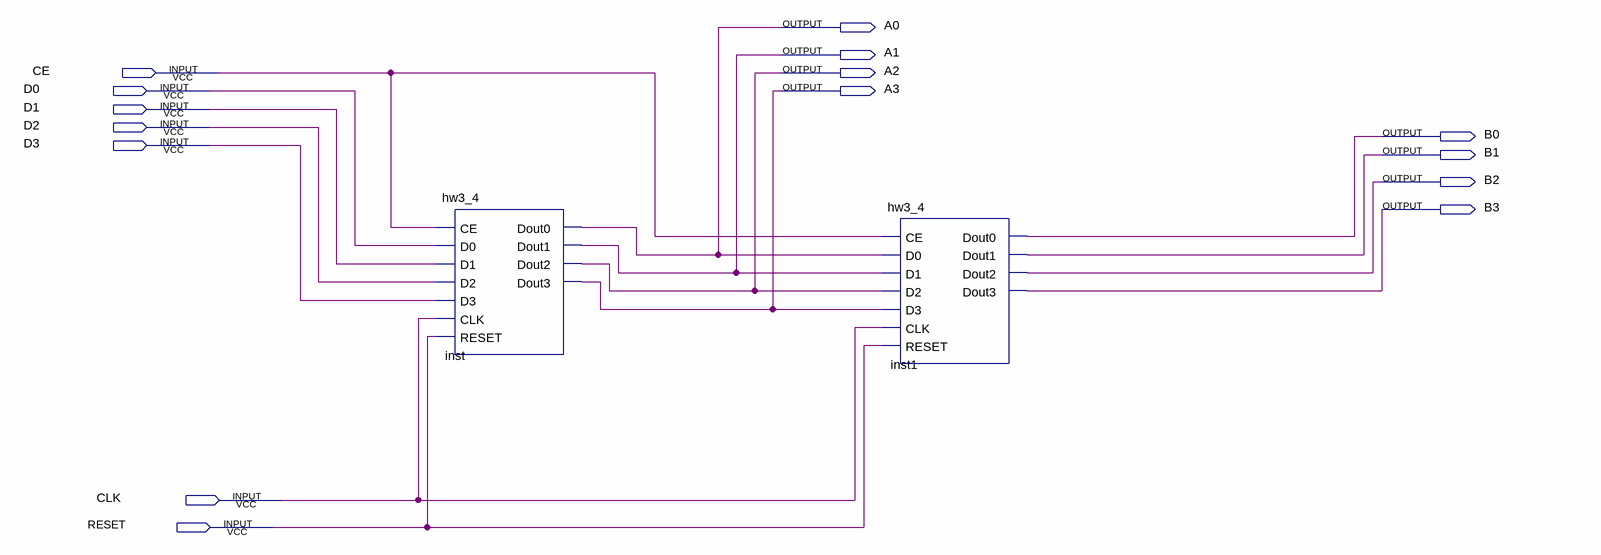
[diagram p0: schematic sheet]
// Quartus schematic hw3_5.bdf as structural Verilog: 2 symbols, 15 pins
module hw3_5 (
  input  CE,
  input  D0,
  input  D1,
  input  D2,
  input  D3,
  input  CLK,
  input  RESET,
  output A0,
  output A1,
  output A2,
  output A3,
  output B0,
  output B1,
  output B2,
  output B3
);

  hw3_4 inst (
    .CE(CE), .D0(D0), .D1(D1), .D2(D2), .D3(D3), .CLK(CLK), .RESET(RESET), .Dout0(A0), .Dout1(A1),
    .Dout2(A2), .Dout3(A3));
  hw3_4 inst1 (
    .CE(CE), .D0(A0), .D1(A1), .D2(A2), .D3(A3), .CLK(CLK), .RESET(RESET), .Dout0(B0), .Dout1(B1),
    .Dout2(B2), .Dout3(B3));
endmodule
